# EAGLE schematic 1channelAmp (EAGLE 9.3.0)
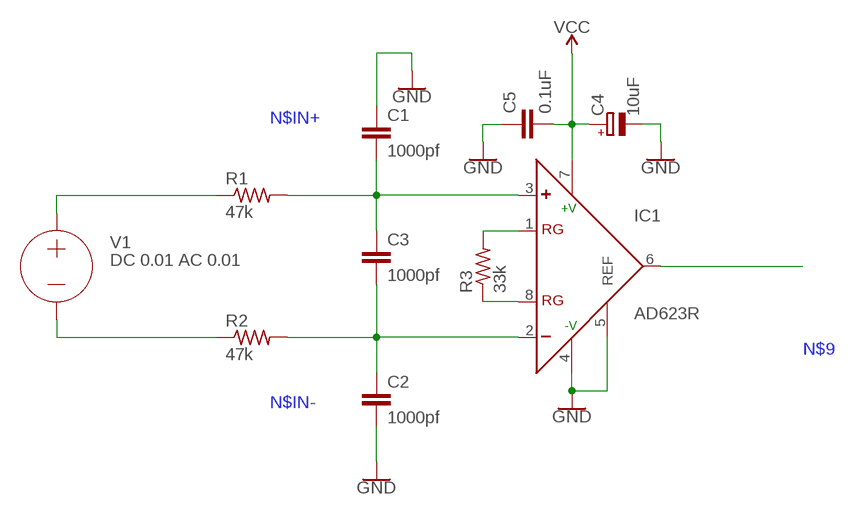
[diagram p0: schematic, sheet 1]

## Parts
C1  1000pf  C-EUC0805  [C0805]
C2  1000pf  C-EUC0805  [C0805]
C3  1000pf  C-EUC0805  [C0805]
C4  10uF  AVX-CAPACITOR-F38M  [AVX-F-M-0603]
C5  0.1uF  C-EUC0805  [C0805]
IC1  AD623R  [SO8]
R1  47k  R-US_R0402  [R0402]
R2  47k  R-US_R0402  [R0402]
R3  33k  R-US_R0402  [R0402]
V1  DC 0.01 AC 0.01  VOLTAGE  (no package)

## Nets
GND: C1.1 C2.2 C4.N(-) C5.1 IC1.4(-V) IC1.5(REF)
N$3: R1.1 V1.+
N$4: R2.1 V1.-
N$5: IC1.1(RG) R3.2
N$6: IC1.8(RG) R3.1
N$9: IC1.6(OUT)
N$IN+: C1.2 C3.1 IC1.3(+) R1.2
N$IN-: C2.1 C3.2 IC1.2(-) R2.2
VCC: C4.P(+) C5.2 IC1.7(+V)

## Library data of the parts
C1 C3 = rcl:C-EU: CAPACITOR, European symbol; SPICEPREFIX: C; TOLERANCE: 2%
C2 C5 = rcl:C-EU: CAPACITOR, European symbol; SPICEPREFIX: C
C4 = RyanWilliams_EMG:AVX-CAPACITOR-F38: Conductive Polymer, Miniature, Undertab Solid Electrolytic Chip Capacitors Datasheet: https://www.mouser.com/datasheet/2/40/f38-775706.pdf; SPICEPREFIX: C; SPICEPRFIX: C
IC1 = analog-devices:AD623: Single-Supply, Rail-to-Rail, Low Cost Instrumentation Amplifier Source: http://www.analog.com/static/imported-files/data_sheets/AD623.pdf; MPN: AD623ARZ.; OC_FARNELL: 9426213; OC_NEWARK: 31M4186; SPICEMODEL: ad623; SPICEPREFIX: X
R1-R3 = rcl:R-US_: RESISTOR, American symbol; SPICEPREFIX: R
V1 = ngspice-simulation:VOLTAGE: Independent Voltage Source, either DC, AC, PULSE, SINE, PWL, EXP, or SFFM; VALUE: 0V